# Altium schematic sheet TPMP1470GJ-Z.SchDoc
size A4; SheetNumber: 4; SheetTotal: 7
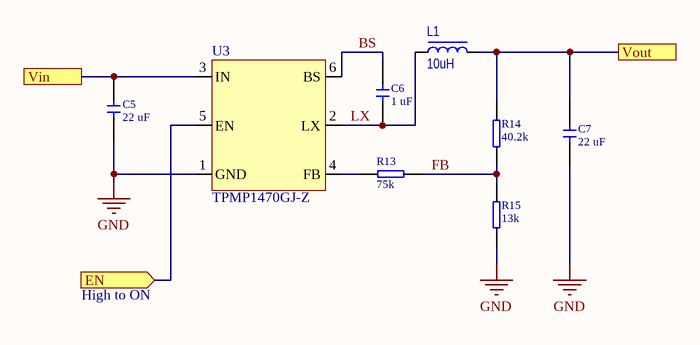
[diagram p0: TPMP1470GJ-Z.SchDoc]

## Parts
C5  value 22 uF  [CERCAP 0805]
C6  value 1 uF  [CERCAP 0603]
C7  value 22 uF  [CERCAP 0805]
L1  value 10uH  [FXL0420]
R13  value 75k  [RES 0402]
R14  value 40.2k  [RES 0402]
R15  value 13k  [RES 0402]
U3  TPMP1470GJ-Z  [SOT23-6]

## Ports
EN (in), Vin, Vout

## Nets
GND: C5.1 C7.1 R15.1 U3.1(GND)
BS: C6.2 U3.6(BS)
EN: U3.5(EN) ; port EN
FB: R13.2 R14.1 R15.2
LX: C6.1 L1.1 U3.2(LX)
Vin: C5.2 U3.3(IN) ; port Vin
Vout: C7.2 L1.2 R14.2 ; port Vout
NetR13_1: R13.1 U3.4(FB)

## Notes on the sheet
- High to ON

## Library data of the parts
C5-C7 = !Capacitor: Capacitor; IsSMT: NoSMT; Diel: X7R; Voltage: *
L1 = Inductor: IsSMT: NoSMT
R13-R15 = !Resistor: Resistor; IsSMT: NoSMT